# Altium schematic sheet ANTENNE.SchDoc: Antenne
size A4; Revision: v1.0; SheetNumber: 6; SheetTotal: 7
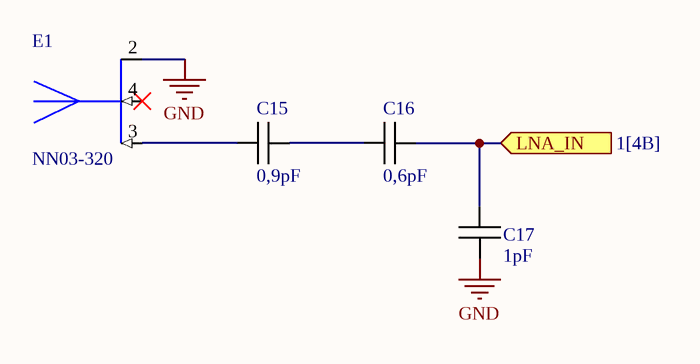
[diagram p0: ANTENNE.SchDoc]

## Parts
C15  0,9pF  [CAPC1005X06N]
C16  0,6pF  [CAPC1005X06N]
C17  1pF  [CAPC1005X06N]
E1  NN03-320  [XCVR_NN03-320]

## Ports
LNA_IN (in, see 1[4B])

## Nets
GND: C17.1 E1.2(GROUND)
LNA_IN: C16.2 C17.2 ; port LNA_IN
NetC15_1: C15.1 E1.3(FEED_BLUETOOTH)
NetC15_2: C15.2 C16.1

Not connected (* = marked no-connect by the designer): E1 4(FEED_GNSS)*

## Library data of the parts
C15-C17 = Capacitor
E1 = NN03-320: Dual port antenna booster for GNSS, Bluetooth, 5G and UWB (1561 - 1606MHz, 2400 - 2500MHz, 3400 - 3800MHz, 3100 - 4800MHz and 6000 - 10600 MHz), signal booster; Manufacturer_Name: Ignion; Manufacturer_Part_Number: NN03-320; Mouser Part Number: 128-NN03-320